# EAGLE design DyIO_Rev12 (EAGLE 5.11)
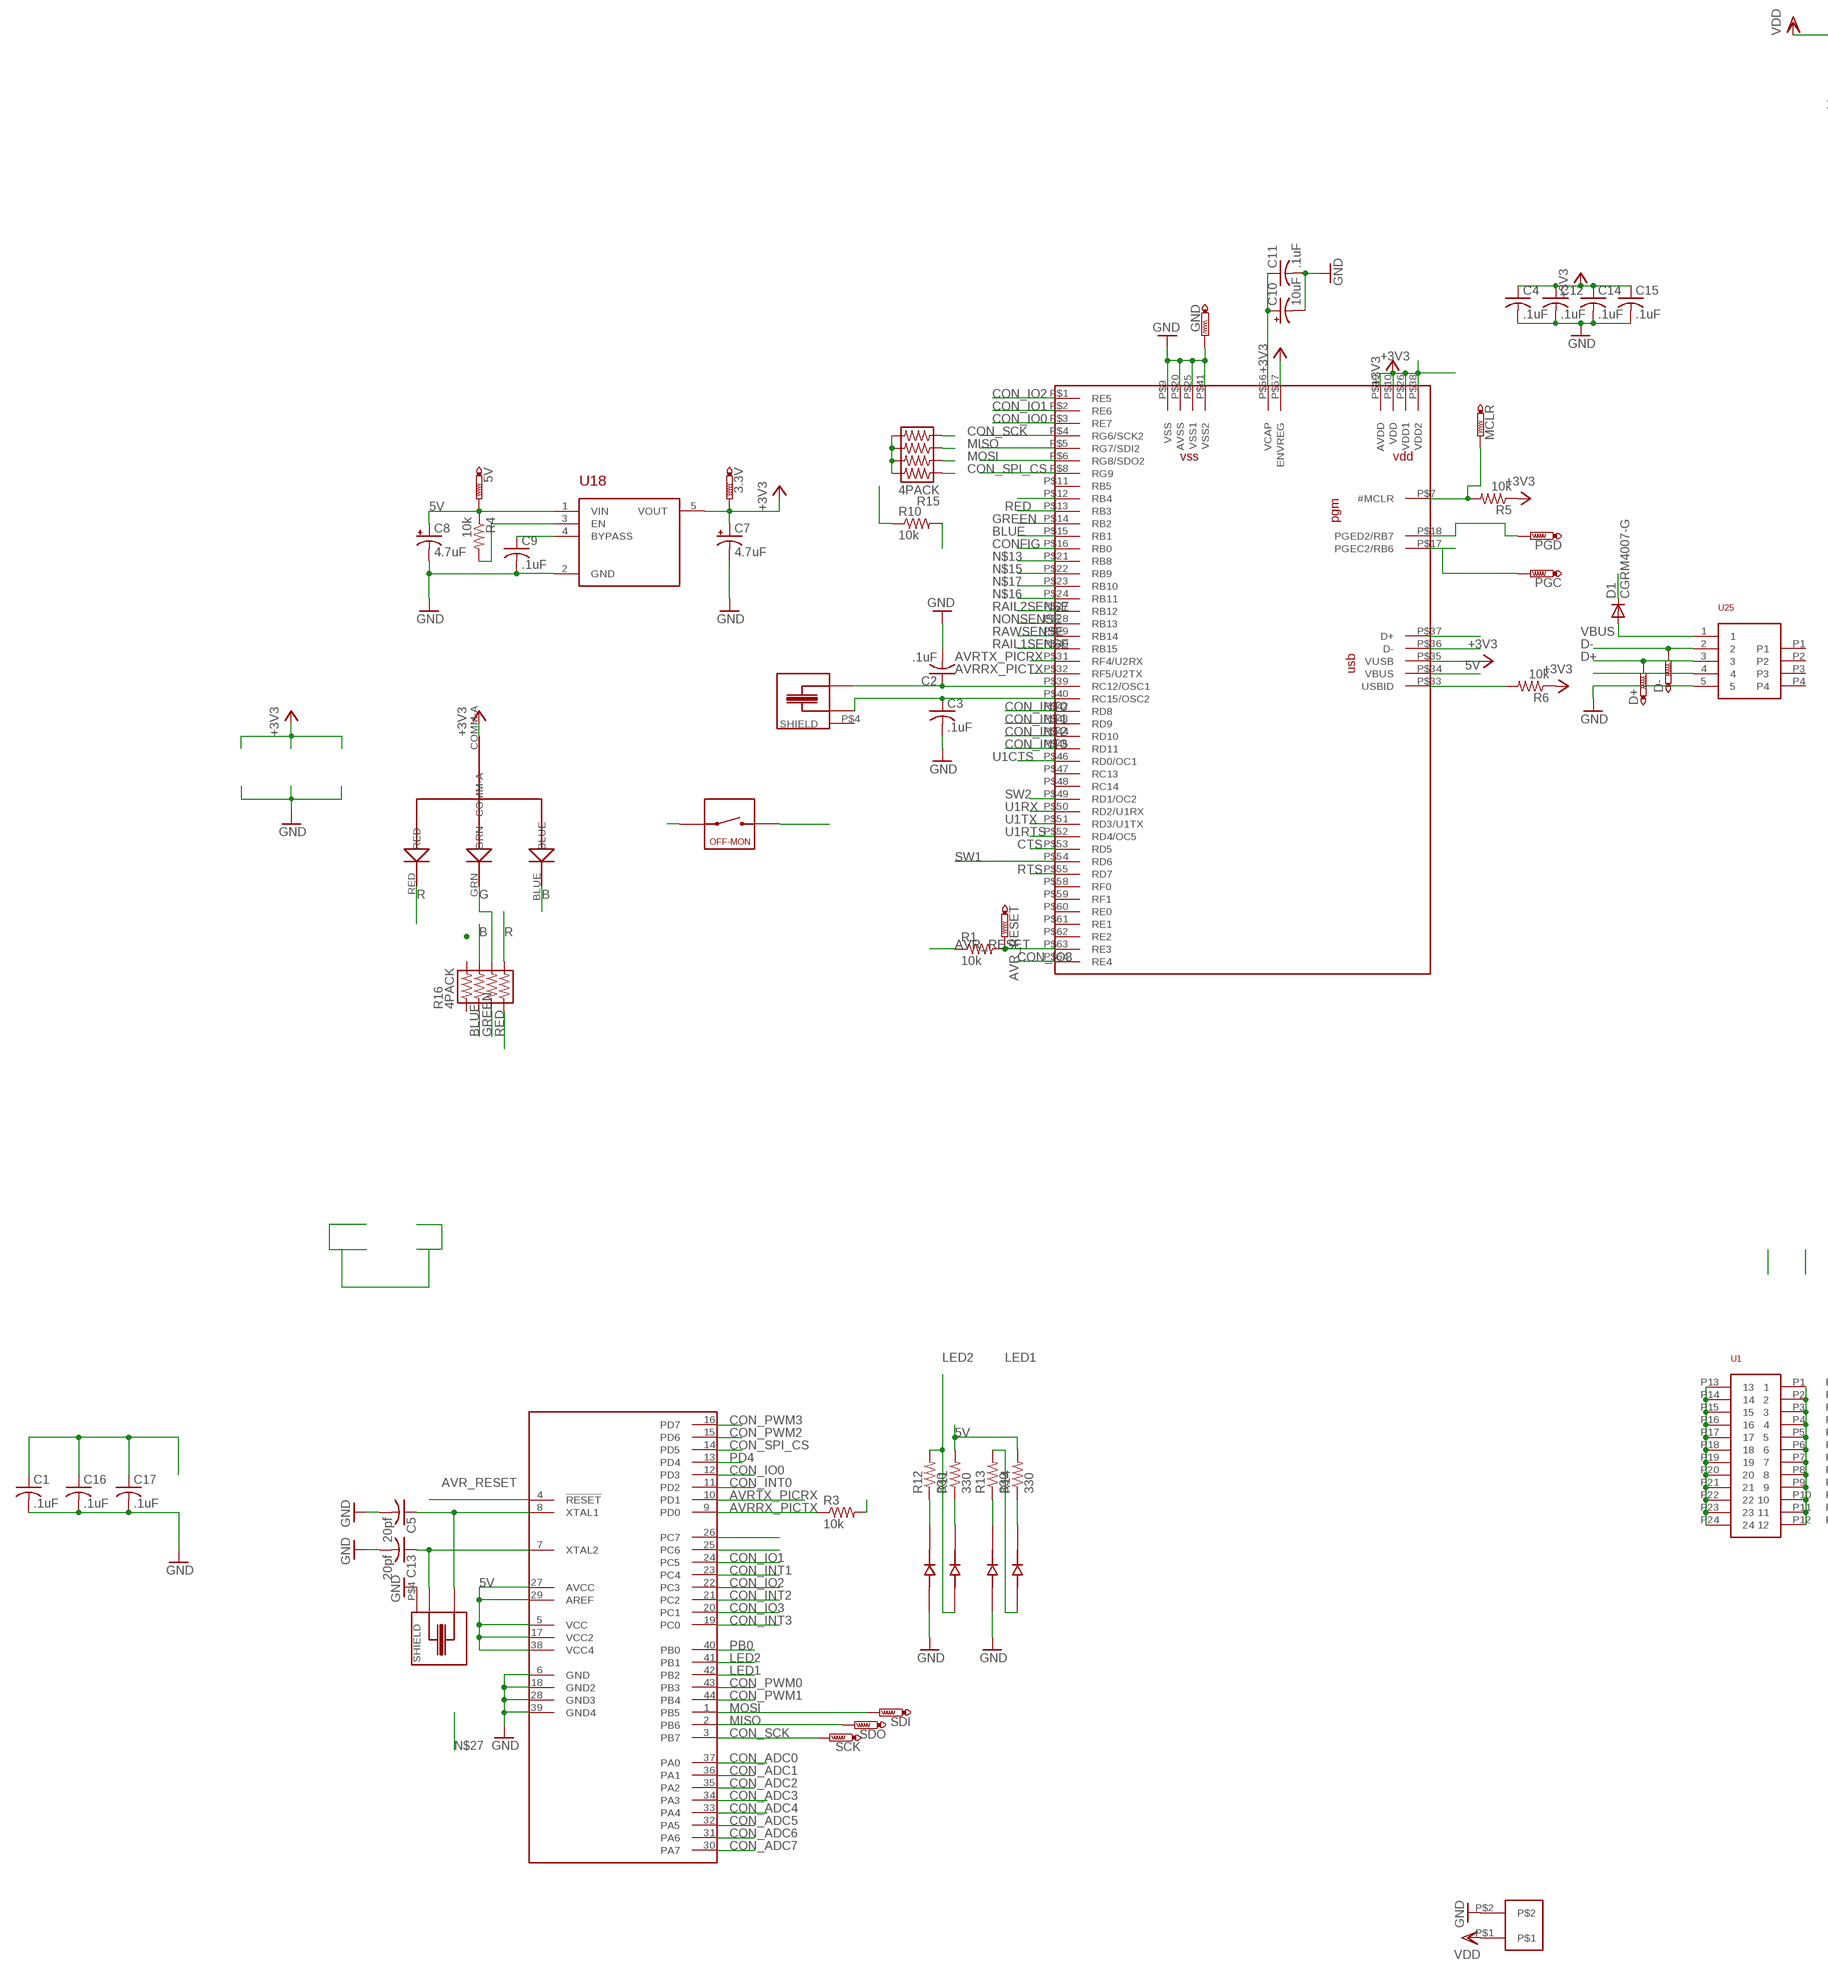
[diagram p0: schematic, sheet 1, part 1 of 2]
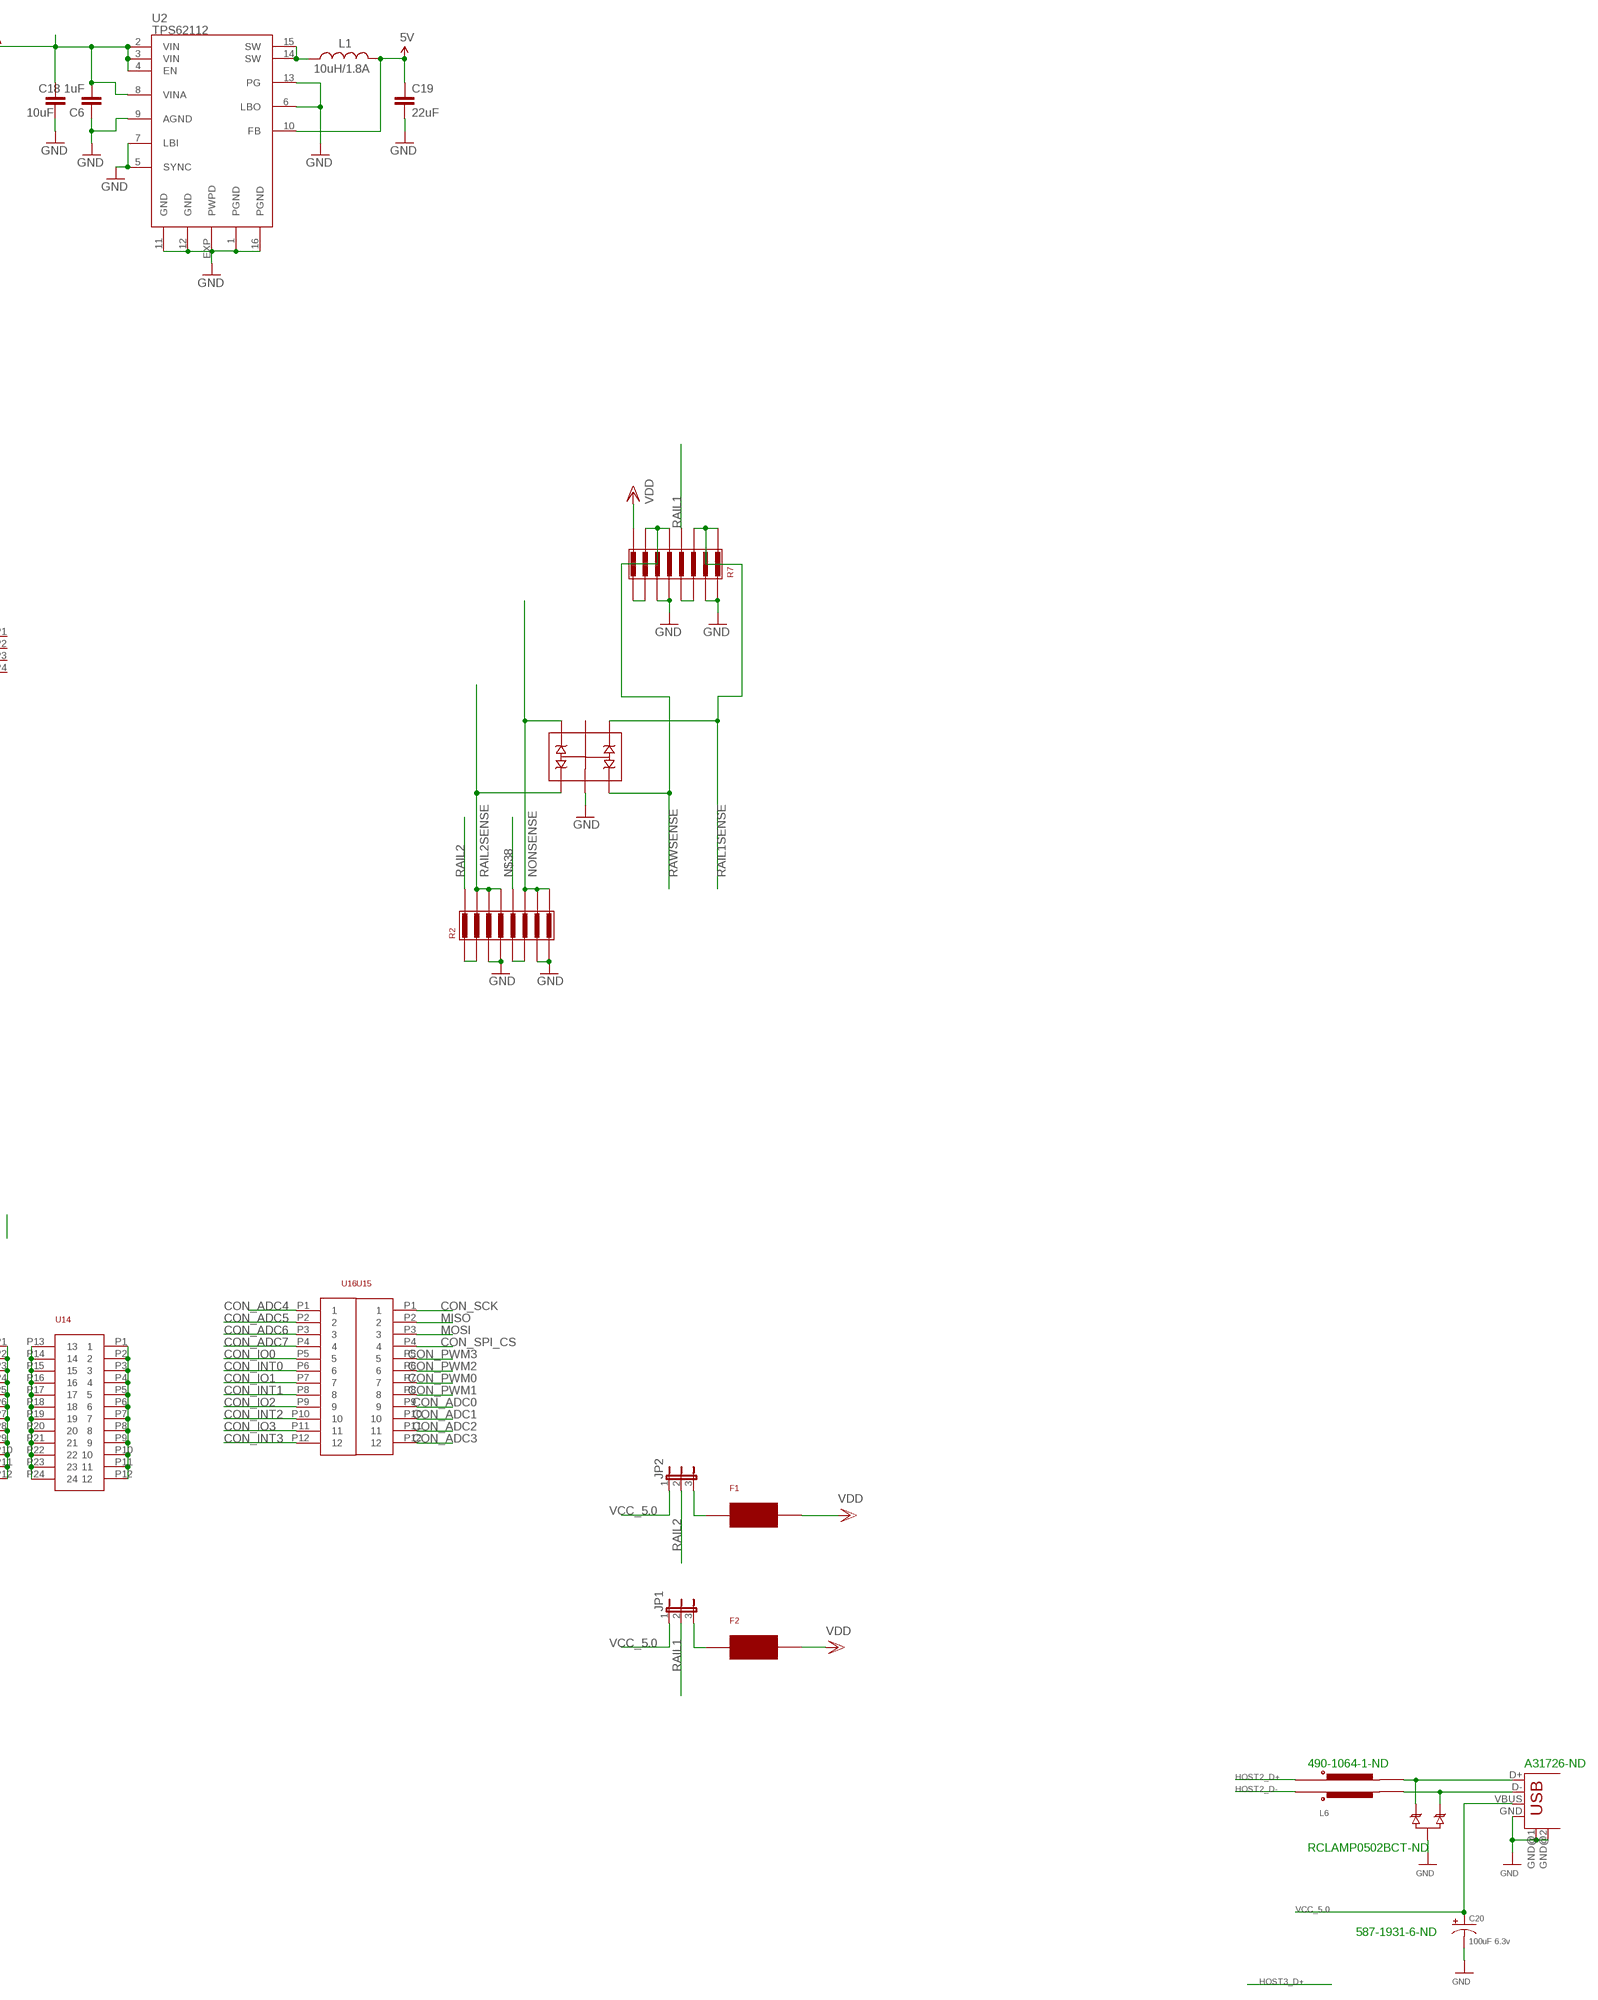
[diagram p1: schematic, sheet 1, part 2 of 2]

## Parts
3.3V  PTR1TP14R  [TP14R]
5V  PTR1TP14R  [TP14R]
AVR_RESET  PTR1TP14R  [TP14R]
C1  .1uF  C-USC0603  [C0603]
C2  .1uF  C-USC0603  [C0603]
C3  .1uF  C-USC0603  [C0603]
C4  .1uF  C-USC0603  [C0603]
C5  20pf  C-USC0603  [C0603]
C6  1uF  CAP0805  [0805]
C7  4.7uF  CPOL-USR/2012-12R  [R/2012-12R]
C8  4.7uF  CPOL-USR/2012-12R  [R/2012-12R]
C9  .1uF  C-USC0402  [C0402]
C10  10uF  CPOL-USR/2012-12R  [R/2012-12R]
C11  .1uF  C-USC0603  [C0603]
C12  .1uF  C-USC0603  [C0603]
C13  20pf  C-USC0603  [C0603]
C14  .1uF  C-USC0603  [C0603]
C15  .1uF  C-USC0603  [C0603]
C16  .1uF  C-USC0603  [C0603]
C17  .1uF  C-USC0603  [C0603]
C18  10uF  CAP1210  [1210]
C19  22uF  CAP1210  [1210]
C20  100uF 6.3v  CPOL-USE1.8-4  [E1,8-4]
D1  CGRM4007-G  [SOD-123_MINI-SMA]
D+  PTR1TP14R  [TP14R]
D-  PTR1TP14R  [TP14R]
F1  0154  [0154]
F2  0154  [0154]
GND  PTR1B1,27  [B1,27]
JP1  JP2E  [JP2]
JP2  JP2E  [JP2]
L1  10uH/1.8A  INDUCTORSRU5028  [SRU5028]
L6  FERITE_S0805  [SPLIT_0805]
MCLR  PTR1TP14R  [TP14R]
PGC  PTR1TP14R  [TP14R]
PGD  PTR1TP14R  [TP14R]
R1  10k  R-US_R0603  [R0603]
R2  741X163  [741X163]
R3  10k  R-US_R0603  [R0603]
R4  10k  R-US_R0402  [R0402]
R5  10k  R-US_R0603  [R0603]
R6  10k  R-US_R0603  [R0603]
R7  741X163  [741X163]
R10  10k  R-US_R0603  [R0603]
R11  330  R-US_R0603  [R0603]
R12  330  R-US_R0603  [R0603]
R13  330  R-US_R0603  [R0603]
R14  330  R-US_R0603  [R0603]
R15  4PACK  [4PACK_0603]
R16  4PACK  [4PACK_0603]
SCK  PTR1TP14R  [TP14R]
SDI  PTR1TP14R  [TP14R]
SDO  PTR1TP14R  [TP14R]
SW3  SPST  [B3U-1000P]
U1  2X12  [2X12]
U2  TPS62112  TPS6211  [QFN16-4X4]
U3  PIC32-64TQFP64-2  [TQFP64-2]
U6  RCLAMP0502B  [SOT-523]
U7  2CLED  [1.6X1.5]
U8  TRI-LED-SMD  [TRI_LED_SMD]
U13  2CLED  [1.6X1.5]
U14  2X12  [2X12]
U15  1X12  [1X12]
U16  1X12  [1X12]
U18  LDS3985XX33  [SOT23-5]
U25  1734035-1_USB  [1734035-1_1734035]
U$2  ATMEGA644QFP  [TQFP44]
U$19  2P  [2PTH]
U$20  UCLAMP3304A  [UCLAMP3304A]
USB2  USB-A-H  [USB-A-H]
X2  CMR3XXT  [CMR309T]
X4  CMR3XXT  [CMR309T]

## Nets
5V: 5V.TP C1.1 C8.+ C16.1 C17.1 C19.1 D1.C L1.2 R1.1 R3.2 R4.1 R11.2 R14.2 R15.R1A R15.R2A R15.R3A R15.R4A U2.10(FB) U3.P$34(VBUS) U18.1(VIN) U$2.5(VCC) U$2.17(VCC2) U$2.27(AVCC) U$2.29(AREF) U$2.38(VCC4)
32MCLR: MCLR.TP R5.2 U3.P$7(#MCLR)
32PGC: PGC.TP U3.P$17(PGEC2/RB6)
32PGD: PGD.TP U3.P$18(PGED2/RB7)
+3V3: 3.3V.TP C4.1 C7.+ C12.1 C14.1 C15.1 R5.1 R6.1 SW3.P$1 U3.P$10(VDD) U3.P$19(AVDD) U3.P$26(VDD1) U3.P$35(VUSB) U3.P$38(VDD2) U3.P$57(ENVREG) U8.COMM-A U18.5(VOUT)
AVR_RESET: AVR_RESET.TP R1.2 U3.P$63(RE3) U$2.4(!RESET)
AVRRX_PICTX: R3.1 U3.P$32(RF5/U2TX) U$2.9(PD0)
AVRTX_PICRX: U3.P$31(RF4/U2RX) U$2.10(PD1)
B: R16.R2A U8.BLUE
BLUE: R16.R2B U3.P$15(RB1)
CON_ADC0: U15.P9 U$2.37(PA0)
CON_ADC1: U15.P10 U$2.36(PA1)
CON_ADC2: U15.P11 U$2.35(PA2)
CON_ADC3: U15.P12 U$2.34(PA3)
CON_ADC4: U16.P1 U$2.33(PA4)
CON_ADC5: U16.P2 U$2.32(PA5)
CON_ADC6: U16.P3 U$2.31(PA6)
CON_ADC7: U16.P4 U$2.30(PA7)
CON_INT0: U3.P$42(RD8) U16.P6 U$2.11(PD2)
CON_INT1: U3.P$43(RD9) U16.P8 U$2.23(PC4)
CON_INT2: U3.P$44(RD10) U16.P10 U$2.21(PC2)
CON_INT3: U3.P$45(RD11) U16.P12 U$2.19(PC0)
CON_IO0: U3.P$3(RE7) U16.P5 U$2.12(PD3)
CON_IO1: U3.P$2(RE6) U16.P7 U$2.24(PC5)
CON_IO2: U3.P$1(RE5) U16.P9 U$2.22(PC3)
CON_IO3: U3.P$64(RE4) U16.P11 U$2.20(PC1)
CON_PWM0: U15.P7 U$2.43(PB3)
CON_PWM1: U15.P8 U$2.44(PB4)
CON_PWM2: U15.P6 U$2.15(PD6)
CON_PWM3: U15.P5 U$2.16(PD7)
CON_SCK: R15.R4B SCK.TP U3.P$4(RG6/SCK2) U15.P1 U$2.3(PB7)
CON_SPI_CS: R15.R1B U3.P$8(RG9) U15.P4 U$2.14(PD5)
CONFIG: R10.2 SW3.P$3 U3.P$16(RB0)
CTS: U3.P$53(RD5) U$2.26(PC7)
D+: D+.TP U3.P$37(D+) U25.3
D-: D-.TP U3.P$36(D-) U25.2
G: R16.R3A U8.GRN
GND: C1.2 C2.2 C3.2 C4.2 C5.2 C6.1 C7.- C8.- C9.2 C10.- C11.2 C12.2 C13.2 C14.2 C15.2 C16.2 C17.2 C18.2 C19.2 C20.- GND.PP(TP) R2.R3A R2.R4A R2.R7A R2.R8A R7.R1A R7.R2A R7.R5A R7.R6A R10.1 U1.P13 U1.P14 U1.P15 U1.P16 U1.P17 U1.P18 U1.P19 U1.P20 U1.P21 U1.P22 U1.P23 U1.P24 U2.1(PGND) U2.5(SYNC) U2.6(LBO) U2.7(LBI) U2.9(AGND) U2.11(GND) U2.12(GND) U2.13(PG) U2.16(PGND) U2.EXP(PWPD) U3.P$9(VSS) U3.P$20(AVSS) U3.P$25(VSS1) U3.P$41(VSS2) U6.3 U7.1T U13.1T U14.P1 U14.P2 U14.P3 U14.P4 U14.P5 U14.P6 U14.P7 U14.P8 U14.P9 U14.P10 U14.P11 U14.P12 U18.2(GND) U25.5 U$2.6(GND) U$2.18(GND2) U$2.28(GND3) U$2.39(GND4) U$19.P$2 U$20.2 USB2.GND USB2.GND@1(GND) USB2.GND@2(GND) X4.P$4(SHIELD)
GREEN: R16.R3B U3.P$14(RB2)
HOST2_D+: L6.1
HOST2_D-: L6.4
LED1: R13.2 U13.2T U$2.42(PB2)
LED2: R12.2 U7.2T U$2.41(PB1)
MISO: R15.R3B SDO.TP U3.P$5(RG7/SDI2) U15.P2 U$2.2(PB6)
MOSI: R15.R2B SDI.TP U3.P$6(RG8/SDO2) U15.P3 U$2.1(PB5)
N$2: R4.2 U18.3(EN)
N$3: C9.1 U18.4(BYPASS)
N$4: C3.1 U3.P$40(RC15/OSC2) X2.P$3
N$5: C10.+ C11.1 U3.P$56(VCAP)
N$6: C2.1 U3.P$39(RC12/OSC1) X2.P$1
N$8: C5.1 U$2.8(XTAL1) X4.P$1
N$9: C13.1 U$2.7(XTAL2) X4.P$3
N$10: L6.2 U6.2 USB2.D+
N$12: R7.R7A R7.R8A
N$13: U3.P$21(RB8)
N$14: R12.1 U7.1A
N$15: U3.P$22(RB9)
N$16: U3.P$24(RB11)
N$17: U3.P$23(RB10)
N$19: L6.3 U6.1 USB2.D-
N$20: F1.1 JP2.3
N$21: F2.1 JP1.3
N$23: U3.P$12(RB4)
N$25: R13.1 U13.1A
N$26: R11.1 U7.2A
N$30: R14.1 U13.2A
N$33: R2.R5A R2.R6A
N$35: R7.R3A R7.R4A
N$36: R2.R1A R2.R2A
N$38: R2.R5B
NONSENSE: R2.R6B R2.R7B R2.R8B U3.P$28(RB13) U$20.6
PB0: U$2.40(PB0)
PD4: U$2.13(PD4)
R: R16.R4A U8.RED
RAIL1: R7.R4B U14.P13 U14.P14 U14.P15 U14.P16 U14.P17 U14.P18 U14.P19 U14.P20 U14.P21 U14.P22 U14.P23 U14.P24
RAIL1SENSE: R7.R1B R7.R2B R7.R3B U3.P$30(RB15) U$20.4
RAIL2: JP2.2 R2.R1B U1.P1 U1.P2 U1.P3 U1.P4 U1.P5 U1.P6 U1.P7 U1.P8 U1.P9 U1.P10 U1.P11 U1.P12
RAIL2SENSE: R2.R2B R2.R3B R2.R4B U3.P$27(RB12) U$20.1
RAWSENSE: R7.R5B R7.R6B R7.R7B U3.P$29(RB14) U$20.3
RED: R16.R4B U3.P$13(RB3)
RTS: U3.P$55(RD7) U$2.25(PC6)
SW: L1.1 U2.14(SW) U2.15(SW)
SW1: U3.P$54(RD6)
SW2: U3.P$49(RD1/OC2)
U1CTS: U3.P$46(RD0/OC1)
U1RTS: U3.P$52(RD4/OC5)
U1RX: U3.P$50(RD2/U1RX)
U1TX: U3.P$51(RD3/U1TX)
USBID: R6.2 U3.P$33(USBID) U25.4
VBUS: D1.A U25.1
VCC_5.0: C20.+ JP1.1 JP2.1 USB2.VBUS
VDD: C6.2 C18.1 F1.2 F2.2 R7.R8B U2.2(VIN) U2.3(VIN) U2.4(EN) U2.8(VINA) U$19.P$1
Unconnected: JP1.2 R16.R1A R16.R1B U3.P$11(RB5) U3.P$47(RC13) U3.P$48(RC14) U3.P$58(RF0) U3.P$59(RF1) U3.P$60(RE0) U3.P$61(RE1) U3.P$62(RE2) U25.P1 U25.P2 U25.P3 U25.P4 U$20.5 X2.P$4(SHIELD)

## Notes on the sheet
- 490-1064-1-ND | A31726-ND
- RCLAMP0502BCT-ND
- 587-1931-6-ND

## Library data of the parts
3.3V 5V AVR_RESET D+ D- GND MCLR PGC PGD SCK SDI SDO = testpad:PTR1: TEST PIN
C1-C5 C9 C11-C17 = rcl:C-US: CAPACITOR, American symbol
C6 C18 C19 = SparkFun:CAP: Capacitor Standard 0603 ceramic capacitor, and 0.1" leaded capacitor.
C7 C8 C10 C20 = rcl:CPOL-US: POLARIZED CAPACITOR, American symbol
D1 = diode:CGRM400*-G: Molded plasitc,JEDEC SOD-123/Mini SMA Source: Comchip CGRM4001-G.pdf
F1 F2 = SMT_Fuse_0154001:0154
JP1 JP2 = jumper:JP2E: JUMPER
L1 = SparkFun:INDUCTOR: Inductors Basic Inductor/Choke - 0603 and 1206. Footprints are not proven and vary greatly between part numbers.
L6 = ferrite_split_0805:FERITE_S0805
R1 R3-R6 R10-R14 = rcl:R-US_: RESISTOR, American symbol
R2 R7 = 741X163:741X163
R15 R16 = ResistorBlocks:4PACK: This is a 0603x4 resistor block. Digikey PN:MNR14103RCT-ND
SW3 = B3U-1000P:SPST
U1 U14 = 1x12_header:2X12
U2 = SparkFun:TPS6211*: TPS62112: 1.5A Step-Down Converter
U3 = pic32:PIC32-64
U6 = rclamp0502b:RCLAMP0502B
U7 U13 = 2cled:2CLED: 160-1452-1-ND
U8 = TRI_LED_SMD:TRI-LED-SMD: Common Annode smd tri-color RGB led.
U15 U16 = 1x12_header:1X12
U18 = LDS3985XX33:LDS3985XX33
U25 = YESIN_USB:1734035-1_USB
U$2 = atmega644:ATMEGA644
U$19 = con_2h_70555-0001:2P
U$20 = UCLAMP3304A:UCLAMP3304A
USB2 = con-usb-2:USB: USB Connectors
X2 X4 = cmr3XXT:CMR3XXT

## Board
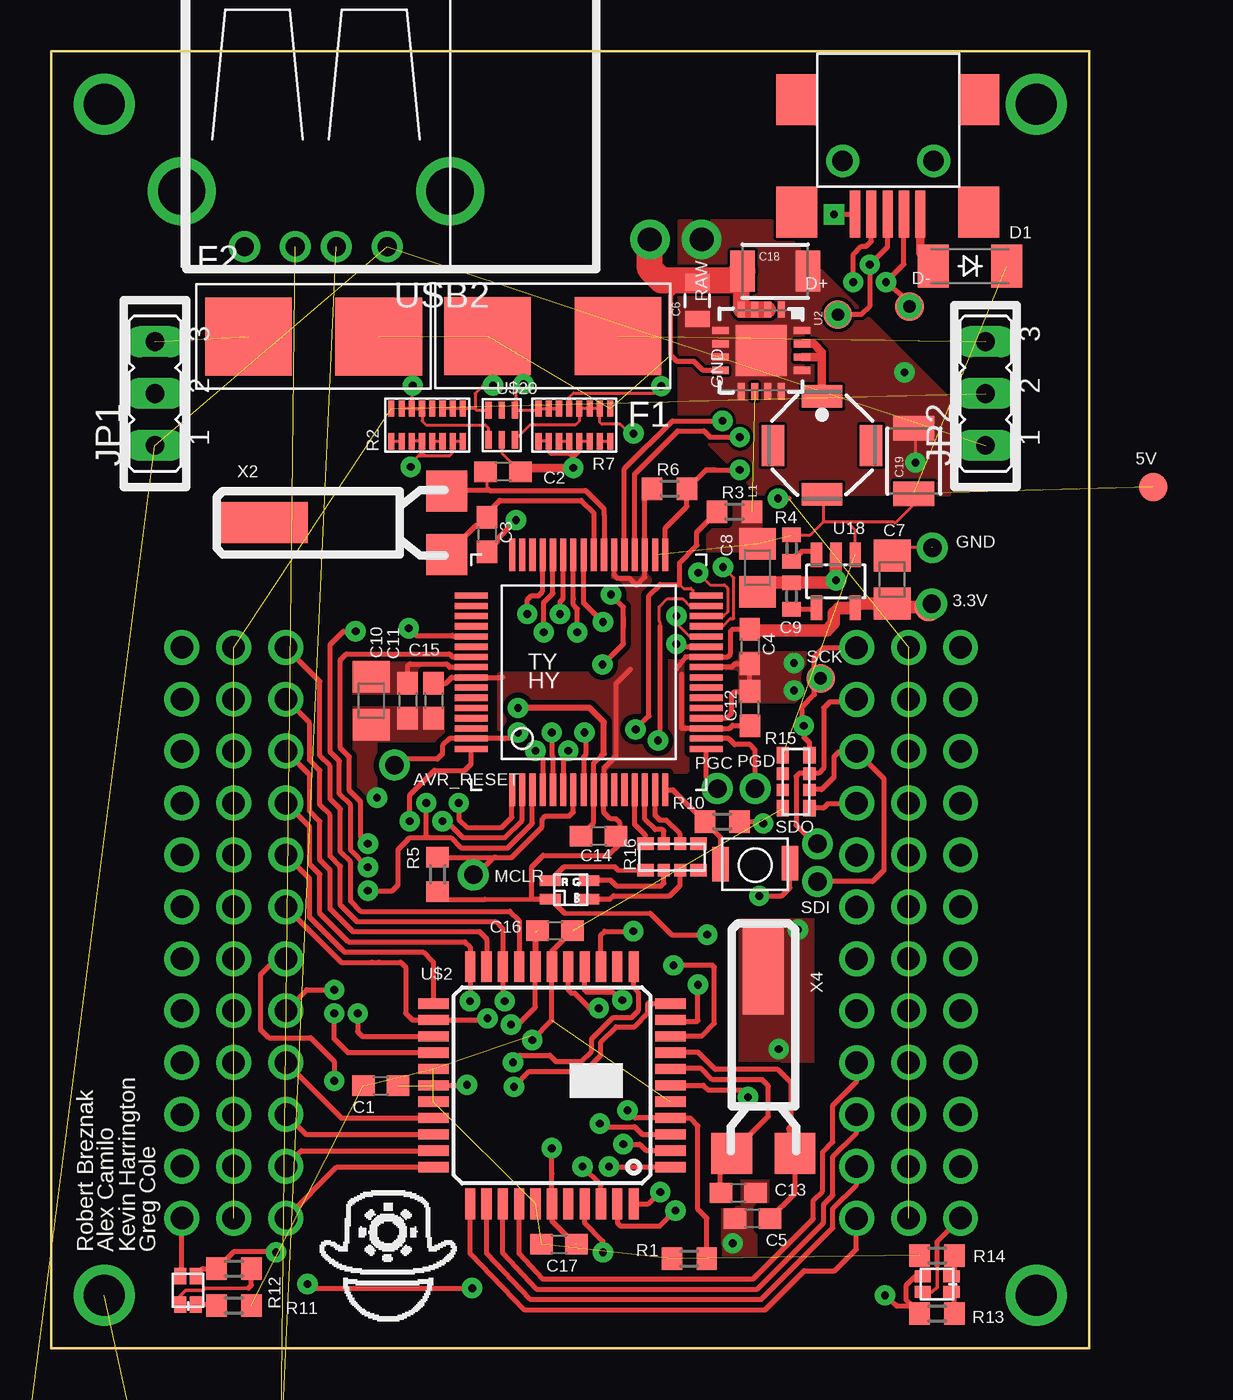
[diagram p2: board, top side]
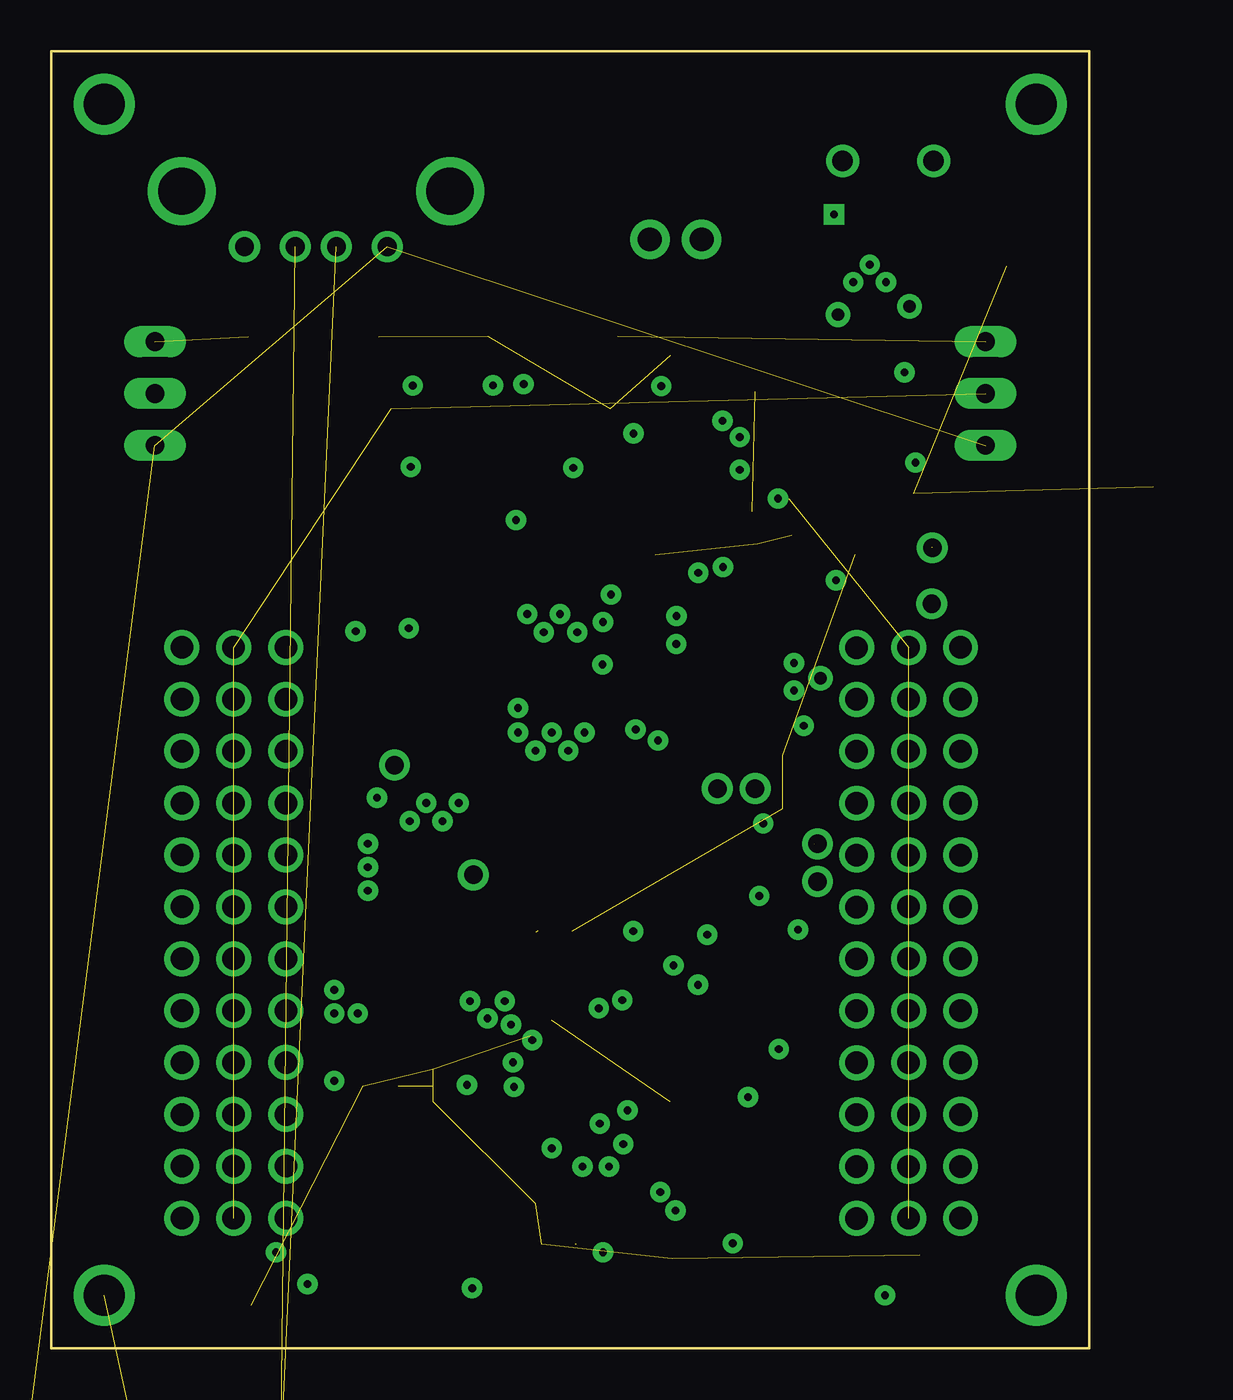
[diagram p3: board, inner layer Route2]
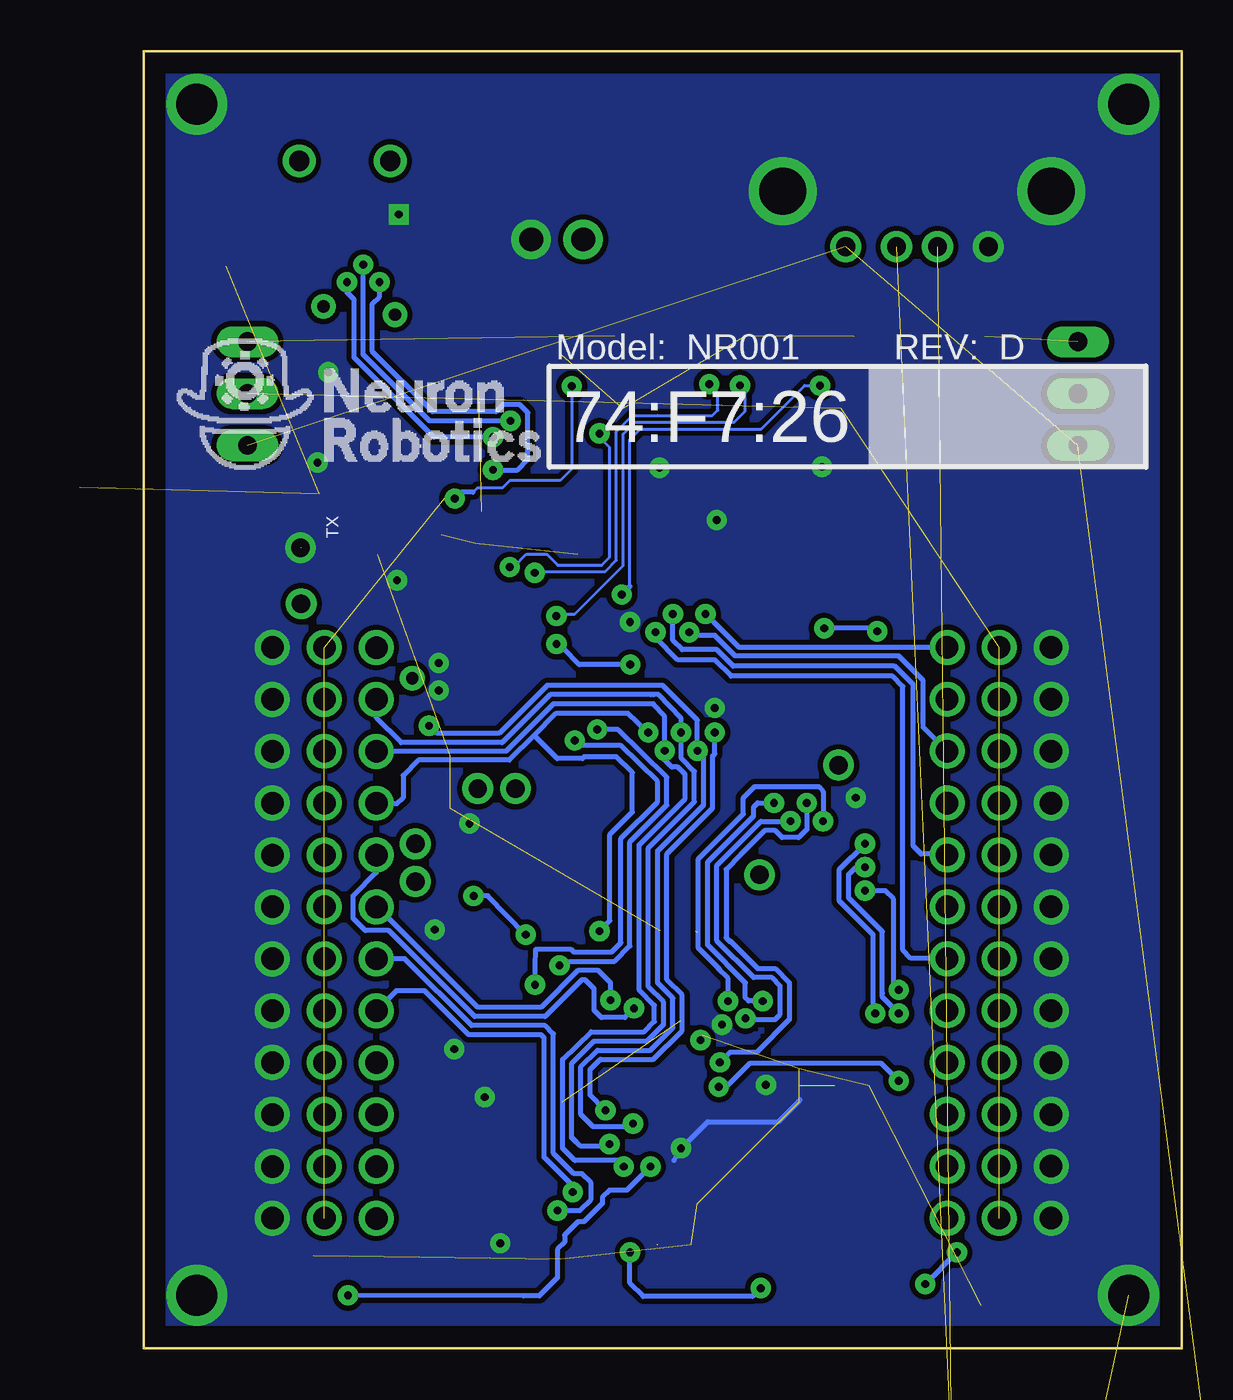
[diagram p4: board, bottom side, seen from below]

Size 50.8 x 63.5 mm. Coordinates in mm from the lower left corner, seen from the top.
Copper layers (1*2+3*16): Top 0.035mm / dielectric 1.5mm / Route2 0.035mm / dielectric 0.15mm / Route3 0.035mm / dielectric 0.2mm / Bottom 0.035mm
Design rules "default *": minimum track width 6mil, minimum drill 15mil, track to track 6mil, track to pad 6mil, pad to pad 6mil, via to via 6mil, smd to smd 6mil, copper to edge 40mil, drill to drill 6mil, minimum pad ring 12mil, minimum via ring 12mil, stop-mask expansion 4mil, vias tented up to drill 20mil, thermal gap 0mil

### Footprints (pad centres in the part's own frame; a part is rotated, then mirrored left to right if it is on the bottom)
TP14R = smd 1.4 x 1.4: TP 0,0
C0603 = smd 1.1 x 1: 1 -0.85,0; 2 0.85,0
0805 = smd 0.8 x 1.2: 1 -0.9,0; 2 0.9,0
R/2012-12R = smd 1.55 x 1.8: + 1.175,0; - -1.175,0
C0402 = smd 0.7 x 0.9: 1 -0.65,0; 2 0.65,0
1210 = smd 1.2 x 2: 1 -1.6,0; 2 1.6,0
E1,8-4 = drill 0.711 pad 1.168 round: + -0.889,0 | drill 0.711 pad 1.168 octagon: - 0.889,0
SOD-123_MINI-SMA = smd 1.5 x 2.1: A 1.8,0; C -1.8,0
0154 = smd 4.24 x 3.81: 1 0,0; 2 6.38,0
B1,27 = smd 1.27 x 1.27: PP 0,0
JP2 = drill 0.914 long: 1 -2.54,0; 2 0,0; 3 2.54,0
SRU5028 = smd 1.1 x 2: 1 2.4,0; 2 -2.4,0 | smd 2 x 1.1: P$1 0,2.4; P$2 0,-2.4
SPLIT_0805 = smd 0.45 x 0.4: 1 0.225,-0.2; 2 1.775,-0.2; 3 1.775,-1; 4 0.225,-1
R0603 = smd 1 x 1.1: 1 -0.85,0; 2 0.85,0
741X163 = smd 0.3 x 0.8: R1A 0,0.4; R1B 0,2; R2A 0.5,0.4; R2B 0.5,2; R3A 1,0.4; R3B 1,2; R4A 1.5,0.4; R4B 1.5,2; R5A 2,0.4; R5B 2,2; R6A 2.5,0.4; R6B 2.5,2; R7A 3,0.4; R7B 3,2; R8A 3.5,0.4; R8B 3.5,2
R0402 = smd 0.7 x 0.9: 1 -0.65,0; 2 0.65,0
4PACK_0603 = smd 0.8 x 0.6: R1A -2.78,-0.6; R1B -2.78,-1.9; R4A -0.18,-0.6; R4B -0.18,-1.9 | smd 0.6 x 0.6: R2A -1.88,-0.6; R2B -1.88,-1.9; R3A -1.08,-0.6; R3B -1.08,-1.9
B3U-1000P = smd 0.8 x 1.7: P$1 0.4,-0.1; P$3 3.8,-0.05
2X12 = drill 1.1 round: P1 -0.635,0.635; P2 1.905,0.635; P3 4.445,0.635; P4 6.985,0.635; P5 9.525,0.635; P6 12.065,0.635; P7 14.605,0.635; P8 17.145,0.635; P9 19.685,0.635; P10 22.225,0.635; P11 24.765,0.635; P12 27.305,0.635; P13 -0.635,-1.905; P14 1.905,-1.905; P15 4.445,-1.905; P16 6.985,-1.905; P17 9.525,-1.905; P18 12.065,-1.905; P19 14.605,-1.905; P20 17.145,-1.905; P21 19.685,-1.905; P22 22.225,-1.905; P23 24.765,-1.905; P24 27.305,-1.905
QFN16-4X4 = smd 0.8 x 0.35: 1 -2,0.975; 2 -2,0.325; 3 -2,-0.325; 4 -2,-0.975; 9 2,-0.975; 10 2,-0.325; 11 2,0.325; 12 2,0.975 | smd 0.35 x 0.8: 5 -0.975,-2; 6 -0.325,-2; 7 0.325,-2; 8 0.975,-2; 13 0.975,2; 14 0.325,2; 15 -0.325,2; 16 -0.975,2 | smd 2.5 x 2.5: EXP 0,0
TQFP64-2 = smd 1.6 x 0.3: P$1 0,-2; P$2 0,-2.5; P$3 0,-3; P$4 0,-3.5; P$5 0,-4; P$6 0,-4.5; P$7 0,-5; P$8 0,-5.5; P$9 0,-6; P$10 0,-6.5; P$11 0,-7; P$12 0,-7.5; P$13 0,-8; P$14 0,-8.5; P$15 0,-9; P$16 0,-9.5; P$33 11.5,-9.5; P$34 11.5,-9; P$35 11.5,-8.5; P$36 11.5,-8; P$37 11.5,-7.5; P$38 11.5,-7; P$39 11.5,-6.5; P$40 11.5,-6; P$41 11.5,-5.5; P$42 11.5,-5; P$43 11.5,-4.5; P$44 11.5,-4; P$45 11.5,-3.5; P$46 11.5,-3; P$47 11.5,-2.5; P$48 11.5,-2 | smd 0.3 x 1.6: P$17 2,-11.5; P$18 2.5,-11.5; P$19 3,-11.5; P$20 3.5,-11.5; P$21 4,-11.5; P$22 4.5,-11.5; P$23 5,-11.5; P$24 5.5,-11.5; P$25 6,-11.5; P$26 6.5,-11.5; P$27 7,-11.5; P$28 7.5,-11.5; P$29 8,-11.5; P$30 8.5,-11.5; P$31 9,-11.5; P$32 9.5,-11.5; P$49 9.5,0; P$50 9,0; P$51 8.5,0; P$52 8,0; P$53 7.5,0; P$54 7,0; P$55 6.5,0; P$56 6,0; P$57 5.5,0; P$58 5,0; P$59 4.5,0; P$60 4,0; P$61 3.5,0; P$62 3,0; P$63 2.5,0; P$64 2,0
SOT-523 = smd 0.4 x 0.8: 1 0,0; 2 1,0; 3 0.5,1.4
1.6X1.5 = smd 0.6 x 0.8: 1A 0.37,0.1; 1T 0.37,1.5; 2A 1.13,0.1; 2T 1.13,1.5
TRI_LED_SMD = smd 1.016 x 0.508: BLUE 1.7,-1.2; COMM-A -0.2,-1.2; GRN 1.7,-0.3; RED -0.2,-0.3
1X12 = drill 1.1 round: P1 -10.795,3.175; P2 -8.255,3.175; P3 -5.715,3.175; P4 -3.175,3.175; P5 -0.635,3.175; P6 1.905,3.175; P7 4.445,3.175; P8 6.985,3.175; P9 9.525,3.175; P10 12.065,3.175; P11 14.605,3.175; P12 17.145,3.175
SOT23-5 = smd 0.55 x 1.2: 1 -0.95,-1.3; 2 0,-1.3; 3 0.95,-1.3; 4 0.95,1.3; 5 -0.95,1.3
1734035-1_1734035 = smd 2.3 x 0.5: 1 -1.15,1.6; 2 -1.15,0.8; 3 -1.15,0; 4 -1.15,-0.8; 5 -1.15,-1.6 | smd 2.5 x 2: P1 -6.75,4.45; P2 -1.25,4.45; P3 -1.25,-4.45; P4 -6.75,-4.45 | drill 1 pad 1.3 round: P$1 -3.75,-2.2; P$2 -3.75,2.25
TQFP44 = smd 1.5 x 0.5: 1 -5.8,4; 2 -5.8,3.2; 3 -5.8,2.4; 4 -5.8,1.6; 5 -5.8,0.8; 6 -5.8,0; 7 -5.8,-0.8; 8 -5.8,-1.6; 9 -5.8,-2.4; 10 -5.8,-3.2; 11 -5.8,-4; 23 5.8,-4; 24 5.8,-3.2; 25 5.8,-2.4; 26 5.8,-1.6; 27 5.8,-0.8; 28 5.8,0; 29 5.8,0.8; 30 5.8,1.6; 31 5.8,2.4; 32 5.8,3.2; 33 5.8,4 | smd 0.5 x 1.5: 12 -4,-5.8; 13 -3.2,-5.8; 14 -2.4,-5.8; 15 -1.6,-5.8; 16 -0.8,-5.8; 17 0,-5.8; 18 0.8,-5.8; 19 1.6,-5.8; 20 2.4,-5.8; 21 3.2,-5.8; 22 4,-5.8; 34 4,5.8; 35 3.2,5.8; 36 2.4,5.8; 37 1.6,5.8; 38 0.8,5.8; 39 0,5.8; 40 -0.8,5.8; 41 -1.6,5.8; 42 -2.4,5.8; 43 -3.2,5.8; 44 -4,5.8
2PTH = drill 1.168 pad 1.93 round: P$1 -2.54,0; P$2 0,0
UCLAMP3304A = smd 0.3 x 0.85: 1 0,-1.025; 2 0.65,-1.025; 3 1.3,-1.025; 4 1.3,0.425; 5 0.65,0.425; 6 0,0.425
USB-A-H = drill 0.914 round: D+ 2.718,-1.003; D- 2.718,1.003; GND 2.718,-3.493; VBUS 2.718,3.493 | drill 2.311 round: GND@1 0,6.566; GND@2 0,-6.566
CMR309T = smd 2 x 2: P$1 1,1.7; P$3 1,-1.4 | smd 4.5 x 2: P$4 -8.05,0.15

### Placement (x,y rotation side)
3.3V  42.95,36.3 0 top
5V  53.92,42.16 0 top  (outside the outline)
AVR_RESET  16.8,28.55 0 top
C1  16.13,12.86 0 top
C2  22.11,42.92 0 top
C3  21.33,39.84 270 top
C4  34.18,34.36 270 top
C5  34.32,6.37 180 top
C6  31.62,51.28 90 top
C7  41.16,37.63 270 top
C8  34.56,38.21 90 top
C9  36.23,36.83 90 top
C10  15.66,31.7 90 top
C11  17.44,31.7 270 top
C12  34.2,31.32 90 top
C13  33.63,7.62 0 top
C14  26.78,25.07 180 top
C15  18.71,31.7 270 top
C16  24.66,20.44 180 top
C17  24.85,5.1 0 top
C18  35.43,52.73 0 top
C19  42.21,43.43 90 top
C20  -4.06,-33.78 0 top  (outside the outline)
D1  44.96,52.98 180 top
D+  38.5,50.6 0 top
D-  42,51 0 top
F1  27.74,49.56 180 top
F2  9.65,49.53 0 top
GND  43.09,39.21 0 top
JP1  5.08,46.74 90 top
JP2  45.72,46.74 90 top
L1  37.72,44.2 90 top
L6  -4.83,-38.1 0 top  (outside the outline)
MCLR  20.66,23.25 0 top
PGC  32.6,27.4 90 top
PGD  34.45,27.4 90 top
R1  31.23,4.39 0 top
R2  16.65,44 0 top
R3  33.44,40.95 0 top
R4  36.23,39.17 270 top
R5  18.91,23.2 90 top
R6  30.26,42.08 0 top
R7  23.85,44 0 top
R10  32.83,25.78 180 top
R11  8.95,2.1 0 top
R12  8.95,3.9 180 top
R13  43.35,1.7 180 top
R14  43.35,4.55 180 top
R15  35.2,29.21 90 top
R16  28.9,22.8 180 top
SCK  37.65,32.8 0 top
SDI  37.5,22.85 0 top
SDO  37.5,24.7 0 top
SW3  36.55,23.65 180 top
U1  8.3,33.68 270 top
U2  34.75,48.84 270 top
U3  20.56,27.35 90 top
U6  9.91,-34.54 0 top  (outside the outline)
U7  5.95,2.05 0 top
U8  24.62,23.2 0 top
U13  44.15,2.4 90 top
U14  43.86,33.68 270 top
U15  42.59,23.51 270 bottom
U16  14.66,17.17 90 top
U18  38.4,37.55 180 top
U25  40.93,54.37 270 top
U$2  24.51,12.88 180 top
U$5  [OUTLINE]  0,0 0 top
U$19  31.83,54.28 0 top
U$20  21.4,45.5 0 top
USB2  12.95,56.64 270 top
X2  18.35,40.27 0 top
X4  34.7,10.55 270 top

### Tracks (layer width: path | path; a pad name or v marks a point on that pad's centre or on a via)
5V  (via drill 0.38)  (19 unrouted)
  Top 0.152: R4.1 37.15,39.82 37.8,40.46 | 37.8,40.46 37.8,41.72 L1.2 | 37.8,40.46 38.41,40.46 38.94,40.46 | 38.94,40.46 39.32,40.08 39.32,38.88 U18.1 | C19.1 42.22,41.3 41.3,40.39 41.22,40.46 38.94,40.46
  Top 0.254: C16.1 24.51,19.44 U$2.17 24.51,16.05 v23.55,15.09
  Route2 0.254: v23.55,15.09 23.55,15.24 23.47,15.32
  pour Top (isolate 0.254): 32.05,41.25 32.05,39 34.8,39 34.8,41.25
32MCLR
  Top 0.254: U3.P$7 25.56,26.26 25.36,26.06 24.19,26.06 24.03,25.9 24.03,25.53 22.53,24.03 21.77,24.03 | 21.77,24.03 21.65,24.03 20.7,23.08 MCLR.TP | R5.2 18.93,24.03 21.77,24.03
32PGC  (via drill 0.9)
  Top 0.152: PGC.TP 32.77,27.94
  Top 0.254: U3.P$17 32.06,29.31 32.05,29.3 | 32.05,29.3 32.05,27.95 PGC.TP | 32.05,29.3 U3.P$17
  other vias: 32.6,27.4
32PGD
  Top 0.254: U3.P$18 33.15,29.85 33.45,29.55 34.2,29.55 34.45,29.3 PGD.TP
+3V3  (via drill 0.38)
  Top 0.254: C12.1 34.17,30.5 33.35,30.5 33.2,30.35 U3.P$19 32.1,30.35 | C4.1 33.35,35.2 33.25,35.1 33.25,34 33.1,33.85 U3.P$26 31.05,33.85 30.6,33.25 | C15.1 19.3,32.55 19.6,32.85 U3.P$57 22.1,32.85 | 32.1,30.35 30.85,30.35 30.85,33 | 32.1,30.35 32.15,30.35 | R6.1 29.06,41.72 U3.P$35 29.06,37.76 28.65,37.35 28.3,37.7 27.7,37.7 27.56,37.84 U3.P$38 | SW3.P$1 36.15,22.55 35.75,22.15 v34.65,22.15 | 27.06,28.34 U3.P$10 27.05,26.23 27.36,25.92 27.63,25.92 27.84,25.71 27.84,24.73 | 27.06,28.34 27.05,28.35 | 27.06,28.34 27.06,28.41 27.65,29 27.65,32.55 28.35,33.25 | 27.84,24.73 C14.1 | v32.1,20.25 30.36,20.25 29.31,21.3 25.11,21.31 U8.COMM-A 23.52,21.99 | R5.1 19.28,21.98 21.23,21.98 21.24,21.99 23.52,21.99 | 27.84,24.73 27.25,24.13 24.08,24.13 23.52,23.57 23.52,21.99
  Top 0.61: 3.3V.TP 41.31,36.3 C7.+ 39.56,36.46 U18.5 38.55,36.25 38.3,36 38.3,35.5 37.95,35.15 34.24,35.15 C4.1
  Bottom 0.254: v32.1,20.25 33.95,22.15 v34.65,22.15
  pour Top (isolate 0.254): 21.95,33 27.4,33 27.4,38.15 27.7,38.15 27.7,37.8 28.9,37.8 28.9,38.2 29.2,38.2 29.2,37.6 31.1,37.6 31.1,33.45 32.1,33.45 32.1,33.2 31.1,33.2 31.1,28.25 27.2,28.25 27.2,27.9 26.9,27.9 26.9,28.55 24.1,28.55 24.1,30.1 21.95,30.1
AVR_RESET  (via drill 0.38)
  Top 0.254: 22.2,29.85 U3.P$63 19.5,29.85 19.15,29.5 19.15,29.1 18.9,28.85 17.1,28.85 AVR_RESET.TP | 22.2,29.85 | v28.2,11.65 28.57,11.28 U$2.4 30.33,11.25 31.3,11.25 31.65,10.9 31.65,6.8 32.08,6.37 R1.2 | 22.2,29.85 22.55,29.85 v22.85,30.15
  Bottom 0.254: v28.2,11.65 28.95,12.4 28.95,13.65 28.45,14.15 25.85,14.15 24.45,15.55 24.45,17.3 25.2,18.05 25.2,24.2 22.95,26.45 22.95,29 22.85,29.1 v22.85,30.15 22.9,30.1
AVRRX_PICTX  (via drill 0.38)
  Top 0.153: 31.4,36.85 31.4,37.1 31.3,37.2 30.95,37.2 30.75,37.4
  Top 0.254: U3.P$32 31.4,36.85 | R3.1 31.6,39.97 31.6,39.3 30.75,38.45 30.75,37.4 29.8,37.4 29.25,36.85 29.25,30.95 v28.6,30.3 | v30.45,18.75 32.35,18.75 32.45,18.65 32.45,15.9 31.85,15.3 30.33,15.3 U$2.9
  Bottom 0.254: v28.6,30.3 27.6,30.3 25.2,27.95 25.2,26.6 27,24.8 27,19.7 27.75,18.95 30.25,18.95 v30.45,18.75
AVRTX_PICRX  (via drill 0.38)
  Top 0.153: 29.8,35.35 29.8,35.55 29.75,35.6 29.75,36.3 30.15,36.7 30.9,36.7 31.25,36.35 U3.P$31
  Top 0.254: U3.P$31 | v31.65,17.8 31.65,16.05 31.6,16 30.38,16 U$2.10 | 29.8,35.35 29.8,29.85 v29.7,29.75
  Bottom 0.254: v29.7,29.75 29.65,29.5 27.45,29.5 25.65,27.75 25.65,26.75 27.45,24.95 27.45,19.85 27.9,19.4 29.75,19.4 29.9,19.55 31.6,19.55 v31.65,17.8
B
  Top 0.254: U8.BLUE 27.35,22 27.51,22.16 30.27,22.15 30.78,22.66 R16.R2A
BLUE
  Top 0.254: U3.P$15 29.56,26.09 29.8,25.85 30.1,25.85 30.78,25.17 R16.R2B
CON_ADC0
  Top 0.254: U$2.37 22.91,4.64 24.05,3.4 34.35,3.4 37.3,6.35 37.3,7.25 37.75,7.7 37.75,9.6 38.25,10.1 38.25,11.9 39.41,13.06 U15.P9
CON_ADC1
  Top 0.254: 39.41,11.16 U15.P10 39.41,10.56 38.25,9.4 38.25,7.5 37.8,7.05 37.8,6.15 34.55,2.9 23.75,2.9 22.11,4.64 U$2.36
CON_ADC2
  Top 0.254: U$2.35 21.31,4.64 23.45,2.4 34.75,2.4 38.25,5.9 38.25,6.85 39.41,8.01 U15.P11
CON_ADC3
  Top 0.254: U$2.34 20.51,4.64 23.15,1.9 34.95,1.9 36.85,3.8 38.35,3.8 39.4,4.85 39.4,6.35 U15.P12
CON_ADC4
  Top 0.254: U16.P1 13.99,8.88 U$2.33
CON_ADC5
  Top 0.254: U16.P2 12.25,9.68 U$2.32
CON_ADC6
  Top 0.254: U$2.31 12.46,10.48 U16.P3
CON_ADC7
  Top 0.254: U16.P4 14.2,11.28 U$2.30
CON_INT0  (via drill 0.38)
  Top 0.254: U3.P$42 25.56,36.71 25.55,36.7 25.55,36.4 25.75,36.2 v25.75,35.05 | U$2.11 29.92,16.88 29.9,16.9 29.2,16.9 29.2,16.4 28.55,15.75 27.65,15.75 26.9,15 26.9,14.35 26.1,13.55 23.4,13.55 v22.65,12.8 | U16.P6 11.02,19.07 10.25,18.3 10.25,15.6 10.65,15.2 12.7,15.2 13.85,14.05 v13.85,13.1
  Bottom 0.153: U16.P6 11.51,19.07 11.52,19.08 11.95,19.08 11.97,19.1
  Bottom 0.254: 25.75,35 v25.75,35.05 25.75,34.8 24.65,33.7 22.85,33.7 22.05,32.9 14.15,32.9 13.65,32.4 13.65,19.5 13.25,19.1 11.97,19.1 11.51,19.1 | 13.85,12.95 v13.85,13.1 14.7,13.95 21.15,13.95 22.3,12.8 v22.65,12.8
CON_INT1  (via drill 0.38)
  Top 0.254: U3.P$43 25.05,36.7 24.9,36.55 v24.9,35.95 | U16.P8 12.65,22.98 12.65,21.1 14.35,19.4 18.2,19.4 18.7,18.9 U$2.23
  Bottom 0.254: v24.9,35.95 24.9,34.65 24.45,34.2 22.75,34.2 21.95,33.4 14.05,33.4 13.15,32.5 13.15,24.6 12.75,24.2 11.53,24.2 U16.P8
CON_INT2  (via drill 0.38)
  Top 0.254: U3.P$44 24.55,36.95 24.1,36.5 v24.1,35.05 | U16.P10 12.65,28.07 12.65,26.3 13.15,25.8 13.15,23.9 13.65,23.4 13.65,21.5 14.75,20.4 20.95,20.4 21.31,20.04 U$2.21
  Bottom 0.254: v24.1,35.05 23.95,34.9 22.85,34.9 21.85,33.9 13.85,33.9 12.65,32.7 12.65,30.4 U16.P10
CON_INT3  (via drill 0.38)
  Top 0.254: U3.P$45 24.05,37.05 23.85,36.85 23.5,36.85 23.3,36.65 v23.3,35.95 | U16.P12 13.15,32.65 13.15,29 13.65,28.5 13.65,26.9 14.15,26.4 14.15,24.3 14.65,23.8 14.65,21.9 15.15,21.4 22.45,21.4 22.91,20.94 U$2.19
  Bottom 0.254: v23.3,35.95 21.66,34.31 U16.P12
CON_IO0  (via drill 0.38)
  Top 0.254: U3.P$3 23.55,25.7 22.35,24.5 20.05,24.5 19.55,25 18.47,25 | U16.P5 12.5,17.55 v13.85,17.55 | v15.5,22.4 16.7,22.4 16.98,22.68 16.98,24.42 17.3,24.75 | U$2.12 28.51,18.61 28.5,18.6 28.5,17.7 28.75,17.4 28.75,16.55 28.4,16.2 27.5,16.2 26.45,15.15 26.45,14.55 25.95,14.05 24.7,14.05 24.4,14.35 22.95,14.35 v22.6,14 | 17.3,24.75 17.46,24.9 | 18.47,25 17.56,25 17.3,24.75 | v18.35,26.7 18.35,25.12 18.47,25
  Bottom 0.152: U16.P5 11.43,16.51 | 21.61,24.14 21.59,24.13
  Bottom 0.254: v18.35,26.7 18.35,25.4 18.75,25 19.55,25 19.9,25.35 20.4,25.35 21.61,24.14 22.3,23.45 22.3,20.1 22.1,19.9 22.1,19.95 20.75,18.6 19.9,18.6 19.2,17.9 19.2,16.1 20.8,14.5 22.1,14.5 v22.6,14 22.4,14 | v13.85,17.55 14.1,17.8 14.1,22 14.5,22.4 v15.5,22.4
CON_IO1  (via drill 0.38)
  Top 0.254: U3.P$2 23.05,25.85 22.2,25 20.15,25 19.35,25.8 v19.15,25.8 | U16.P7 14.2,18.9 15.7,18.9 | 15.7,18.9 16.05,18.9 | v21.35,16.15 21.28,16.08 U$2.24 17.67,16.08 17.35,16.4 17.35,18.65 17.1,18.9 15.7,18.9
  Bottom 0.254: v19.15,25.8 20.6,25.8 22.75,23.65 22.75,19.95 20.95,18.15 20.05,18.15 19.65,17.75 19.65,16.35 19.9,16.1 21.3,16.1 v21.35,16.15
CON_IO2  (via drill 0.38)
  Top 0.254: U3.P$1 22.55,26 22.05,25.5 20.35,25.5 19.95,25.9 v19.95,26.7 | U16.P9 12.65,25.53 12.65,23.7 13.15,23.2 13.15,21.3 14.55,19.9 20.25,19.9 20.51,19.64 U$2.22 v20.51,17.01 v20.5,17
  Bottom 0.254: v19.95,26.7 20.75,26.7 20.95,26.5 20.95,26.05 23.2,23.8 23.2,19.75 21.35,17.9 21.35,17.15 21.2,17 v20.5,17
CON_IO3  (via drill 0.38)
  Top 0.254: U3.P$64 20.55,28.6 20.25,28.3 18.75,28.3 17.55,27.1 v17.55,25.8 | U16.P11 12.65,30.61 12.65,28.8 13.15,28.3 13.15,26.6 13.65,26.1 13.65,24.1 14.15,23.6 14.15,21.7 14.95,20.9 21.75,20.9 22.11,20.54 U$2.20 22.11,17.09 v22.2,17
  Bottom 0.254: v22.2,17 22.2,18.1 22.7,18.6 22.6,18.55 23.65,19.6 23.65,23.95 21.45,26.15 21.45,26.95 20.9,27.5 17.75,27.5 17.55,27.25 v17.55,25.8
CON_PWM0  (via drill 0.38)
  Top 0.254: U$2.43 27.71,6.14 27.85,6 29.8,6 v30.55,6.75
  Bottom 0.254: v30.55,6.75 29.45,6.75 28.9,7.3 28.9,8.1 29.35,8.55 29.75,8.55 30.75,9.55 30.75,15.4 31.15,15.8 34.75,15.8 38.02,19.07 U15.P7
CON_PWM1  (via drill 0.38)
  Top 0.254: U$2.44 29.23,7.08 v29.8,7.65
  Bottom 0.254: v29.8,7.65 29.8,7.95 31.2,9.35 31.2,15.2 31.35,15.35 34.9,15.35 37.05,17.5 38.44,17.5 U15.P8
CON_PWM2  (via drill 0.38)
  Top 0.254: U$2.15 26.11,17.54 26.2,17.45 27.45,17.45 27.85,17.05 v27.95,17.05
  Bottom 0.254: v27.95,17.05 27.95,17.9 28.55,18.5 29.55,18.5 31.35,16.7 34.45,16.7 39.35,21.61 U15.P6
CON_PWM3  (via drill 0.38)
  Top 0.254: U$2.16 25.31,17.54 25.45,17.4 25.6,17.4 26.35,16.65 v26.8,16.65
  Bottom 0.254: v26.8,16.65 27.25,16.2 28.4,16.2 28.75,16.55 28.75,17.6 29.2,18.05 29.35,18.05 31.15,16.25 34.6,16.25 38.8,20.45 39.95,20.45 40.55,21.05 40.55,22.15 39.41,23.29 U15.P5
CON_SCK  (via drill 0.38, 0.6)
  Top 0.152: U15.P1 39.37,34.29 39.37,34.3
  Top 0.254: 24.05,27.4 U3.P$4 | 24.05,27.4 24.05,28.9 v23.7,29.25 | U$2.3 28.92,10.48 28.55,10.85 27,10.85 v26.85,11 | U15.P1 39.37,34.3 37.8,34.3 37.35,33.85 37.35,32.6 | 37.35,32.6 37.35,32 36.75,31.4 36.75,30.6 36.85,30.5 36.85,30.45 | SCK.TP 37.55,32.8 37.35,32.6 | R15.R4B 37.1,29.05 37.1,29.65 36.85,29.9 36.85,30.45 | U3.P$4 24.06,27.39 24.05,27.4 | v36.83,30.48 v36.83,30.47 36.85,30.45
  Bottom 0.254: 25.85,32.45 25.4,32.45 23.7,30.75 v23.7,29.25 23.4,28.95 23.4,26.6 25.65,24.35 25.65,17.9 24.9,17.15 24.9,15.7 26,14.6 28.6,14.6 29.4,13.8 29.4,11.45 28.8,10.85 27,10.85 v26.85,11 26.75,10.9 | 25.85,32.45 26.15,32.45 | 25.85,32.45 31.05,32.45 33.4,30.1 36.45,30.1 v36.83,30.48
  other vias: 37.65,32.8
CON_SPI_CS  (via drill 0.38)
  Top 0.152: 39.37,26.65 39.37,26.67 U15.P4
  Top 0.254: U3.P$8 26.05,28.95 26.15,29.05 26.15,30.1 v26.1,30.15 | U$2.14 26.91,20.24 27.08,20.42 v28.49,20.42 28.47,20.4 | 39.4,26.65 39.37,26.65 38,26.65 37.8,26.45 37.15,26.45 37.13,26.43 R15.R1B
  Bottom 0.152: U15.P4 39.37,26.67 39.37,26.65
  Bottom 0.254: 39.38,26.65 39.37,26.65 38.4,26.65 38.1,26.95 38.1,28.05 37.35,28.8 32.9,28.8 31.7,30 | 31.7,30 30.6,31.1 27.1,31.1 v26.1,30.15 | v28.49,20.42 27.98,20.93 27.98,25.15 26.88,26.25 26.88,28.18 27.66,28.96 29.24,28.96 29.33,28.87 30.56,28.87 31.7,30
CONFIG
  Top 0.254: U3.P$16 30.42,27.35 R10.2 32.75,25.02 SW3.P$3
CTS  (via drill 0.38)
  Top 0.254: v17.5,35.25 17.85,34.9 19.65,34.9 19.7,34.85 U3.P$53 | v14.9,35.1 14.3,35.1 13.65,34.45 13.65,29.2 14.1,28.75 14.1,27.15 14.65,26.6 14.65,24.4 v15.5,23.55 | U$2.26 14.52,14.48 13.85,15.15 v13.85,16.4
  Bottom 0.254: v17.5,35.25 15.05,35.25 v14.9,35.1 | v15.5,23.55 15.95,23.55 16.3,23.2 16.3,22.05 14.65,20.4 14.65,17.4 14.65,17.2 v13.85,16.4
D+  (via drill 0.38, 0.6)
  Top 0.254: U3.P$37 28.06,43.06 30.4,45.4 v32.85,45.4 | D+.TP 39.65,50.6 40.05,51 v40.05,53.04 40.93,53.92 U25.3
  Bottom 0.254: v40.05,53.04 40.05,48.65 36.8,45.4 v32.85,45.4
  other vias: 38.5,50.6
D-  (via drill 0.38, 0.6)
  Top 0.254: U3.P$36 28.56,42.81 30.65,44.9 31.95,44.9 32.25,44.6 v33.7,44.6 | D-.TP 42,51.25 v40.85,52.19 41.73,53.07 U25.2
  Bottom 0.254: v40.85,52.19 40.85,51.69 40.5,51.34 40.5,48.5 36.6,44.6 v33.7,44.6
  other vias: 42,51
G
  Top 0.254: U8.GRN 26.34,22.91 27.38,22.91 27.65,22.64 29.83,22.63 29.98,22.78 R16.R3A
GND  (via drill 0.38, 0.9, 2)  (6 unrouted)
  Top 0.152: C19.2 42.29,44.96 v42.29,43.36
  Top 0.153: U$20.2 22.05,43.83 C2.2 | R7.R1A R7.R2A 24.35,43.85 24.45,43.75 25.35,43.75 | R7.R6A R7.R5A 25.85,43.85 25.75,43.75 | R2.R3A R2.R4A 18.15,43.85 | R2.R8A R2.R7A 19.65,43.85 19.5,43.7 18.3,43.7 | 18.15,43.85 18.3,43.7 | v17.6,43.15 17.6,43.3 18,43.7 | 18,43.7 18.15,43.85 | 18,43.7 18.3,43.7 | 25.75,43.75 25.45,43.75 | v25.55,43.1 25.55,43.55 | 25.55,43.55 25.75,43.75 | 25.55,43.55 25.35,43.75 | 25.35,43.75 25.45,43.75 | 25.45,43.75 25.55,43.65 | GND.PP 41.56,39.21
  Top 0.17: 43.35,4.05 43.35,3 43.12,2.77 U13.1T
  Top 0.254: U3.P$25 33.3,33.35 33.45,33.5 C4.2 34.2,33.49 C12.2 34.17,32.15 33.45,32.15 33.3,32 33.3,31.1 33.05,30.85 U3.P$20 | 25.65,5.1 24.51,6.24 U$2.39 24.51,8.56 v24.5,9.8 | 27.05,29.1 26.92,28.99 26.55,28.65 U3.P$9 26.55,25.72 26.13,25.3 C14.2 | U$2.6 31.92,12.88 32.15,12.65 33.75,12.65 v34.1,12.3 | R10.1 34.85,25.78 v34.85,25.7 | U14.P12 43.35,5.23 43.35,4.05 | 41.56,39.21 C7.- | v20.35,12.9 20.33,12.88 U$2.28 18.68,12.86 | U7.1T 6.39,3.62 U1.P24 | C3.2 21.85,39.51 21.85,39.65 v22.75,40.55 | U3.P$41 26.06,36.49 v27,35.55 | v22.5,15.85 22.85,15.85 23.7,16.7 U$2.18 | U25.5 39.3,55.49 v38.31,55.5
  Top 0.305: v22.85,31.35 26.35,31.35 27.05,30.65 27.05,29.11 26.92,28.99 | U$2.18 23.71,20.35
  Top 0.406: C2.2 23.15,43.1 v25.55,43.1
  Top 0.61: U18.2 v38.4,37.6 38.18,37.48 C9.2 35,37.48 C8.-
  Bottom 0.152: v42.29,43.36 42.37,43.28 42.44,43.28
  Bottom 0.153: v43.12,39.19 42.88,39.2 42.88,39.21
  Bottom 0.254: v34.1,12.3 34.1,12.05 | 24.85,9.2 v24.5,9.8 23.2,11.1 19.75,11.1 18.68,12.17 | v27,35.55 27,35.3 27.05,35.25 | v38.31,55.5 38.37,55.51 38.37,55.67
  Bottom 0.61: v38.4,37.6 38.25,37.55
  other vias: 36.35,33.55 36.35,32.2 33.35,5.15 36.55,20.5 35.6,14.65 15.95,26.95 2.6,2.6 48.2,2.6 48.2,60.9 2.6,60.9 41.76,47.78
  pour Top (isolate 0.254): 33.65,34.1 36.95,34.1 36.95,31.6 33.65,31.6 33.65,33.1 33.55,33.2 32.85,33.2 32.85,33.5 33.25,33.5 33.45,33.7 33.65,33.7
  pour Top (isolate 0.254): 19.25,31.4 14.75,31.4 14.75,29.7 19.25,29.7
  pour Top (isolate 0.254): 32.8,4.75 32.8,6.95 33.75,6.95 33.75,8.25 35.15,8.25 35.15,6.95 34.55,6.95 34.55,4.5 32.8,4.5
  pour Top (isolate 0.254): 37.35,21.05 37.35,14 33.65,14 33.65,21.05
  pour Top (isolate 0.254): 14.75,29.7 14.75,26.85 15.95,26.85 15.95,29.7
  pour Top: 30.71,55.17 30.71,45.72 34.59,41.83 35.2,41.83 43.97,41.76 43.97,46.48 35.28,55.17
  pour Bottom (isolate 0.254): 0,63.47 0,0 50.83,0 50.83,63.47
GREEN
  Top 0.254: 29.98,24.97 R16.R3B 29.98,25.32 29.9,25.4 29.55,25.4 29.06,25.89 U3.P$14
LED1  (via drill 0.38)
  Top 0.254: U$2.42 26.91,7.06 26.9,7.05 26.9,8 v26,8.9 | v40.8,2.6 41.3,2.15 41.38,2.08 42.12,2.08 | 42.5,1.65 R13.2 42.12,2.08 | 42.12,2.08 41.85,2.35 41.85,3.1 42.28,3.53 U13.2T
  Bottom 0.254: v40.8,2.6 32.2,2.56 31.43,2.56 30.55,3.45 30.55,4.85 30.2,5.2 30.2,5.55 29.55,6.2 29.25,6.2 28.35,7.1 28.35,7.4 28,7.75 27.15,7.75 v26,8.9
LED2  (via drill 0.38)
  Top 0.254: v27,4.7 27,5.25 26.1,6.15 U$2.41 | U7.2T 7.43,3.9 R12.2 8.95,4.75 10.65,4.75 10.7,4.7 v11,4.7 | v20.6,2.95 12.75,2.95 v12.55,3.15
  Bottom 0.254: v27,4.7 27,3.2 26.35,2.55 21,2.55 v20.6,2.95 | v11,4.7 v12.55,3.15
MISO  (via drill 0.38, 0.9)  (1 unrouted)
  Top 0.152: 39.35,31.65 39.37,31.75 U15.P2
  Top 0.254: U3.P$5 24.55,28.95 24.5,29 v24.5,30.15 | 39.35,31.65 38.1,31.65 37.8,31.35 37.8,28.4 37.55,28.15 37.15,28.15 | 37.15,28.15 37.1,28.15 | 37.35,24.7 36.45,25.6 36.45,28 36.58,28.13 R15.R3B 37.13,28.13 37.15,28.15 | v28,10 28.8,10 29.1,9.7 30.28,9.7 U$2.2
  Bottom 0.153: SDO.TP 37.35,24.7
  Bottom 0.254: 29.85,10.3 29.65,10.1 | 29.85,10.3 29.85,13.95 28.75,15.05 26.15,15.05 25.35,15.85 25.35,16.95 26.1,17.7 26.1,24.5 23.85,26.75 23.85,28.25 24.5,28.9 v24.5,30.15 24.5,30.85 25.6,32 25.85,32 | 25.85,32 26,32 | U15.P2 39.41,30.86 38.2,29.65 33.25,29.65 30.9,32 25.85,32 | 29.85,10.3 29.8,10.3 29.4,9.9 28.1,9.9 v28,10 27.85,9.85
  other vias: 37.5,24.7
MOSI  (via drill 0.38, 0.9)
  Top 0.152: 39.37,29.2 39.37,29.21 U15.P3
  Top 0.254: U3.P$6 25.05,29 v25.3,29.25 | 39.4,29.2 39.37,29.2 38.55,29.2 38.3,28.95 38.3,27.95 37.7,27.35 37.15,27.35 | 37.15,27.35 37.1,27.35 | U15.P3 40.75,27.89 40.75,23.4 40.2,22.85 SDI.TP | R15.R2B 37.13,27.33 37.15,27.35 | v27.3,8.9 30.28,8.9 U$2.1
  Bottom 0.254: U15.P3 33.08,29.23 30.75,31.55 25.85,31.55 25.3,30.95 v25.3,29.25 25.3,28.8 24.95,28.45 24.65,28.45 24.3,28.1 24.3,26.9 26.55,24.65 26.55,17.55 25.8,16.8 25.8,16 26.3,15.5 28.9,15.5 30.3,14.15 30.3,9.8 29.7,9.2 27.6,9.2 v27.3,8.9
  other vias: 37.5,22.85
N$2
  Top 0.254: R4.2 36.72,39.01 37.45,39.01 U18.3
N$3
  Top 0.254: C9.1 37.45,36.18 U18.4
N$4
  Top 0.254: U3.P$40 26.55,40.9 25.95,41.5 21.95,41.5 21.65,41.2 21.25,40.71 C3.1 20.94,40.3 20.8,40.3 19.37,38.87 X2.P$3
N$5
  Top 0.254: U3.P$56 19.5,33.35 19.35,33.5 17.55,33.5 17.45,33.4 C11.1
  pour Top (isolate 0.254): 21.35,33.2 19.45,33.2 19.35,33.3 17.95,33.3 17.95,32 14.75,32 14.75,33.7 19.35,33.7 19.55,33.5 21.35,33.5
N$6
  Top 0.153: 21.35,42.1 21.35,42.83 C2.1
  Top 0.254: U3.P$39 27.06,40.79 27.05,40.8 27.05,41.1 26.15,42 21.45,42 21.43,42.02 | 21.43,42.02 21.35,42.1 | X2.P$1 19.41,42.02 21.43,42.02
N$7  (via drill 0.9)
  other vias: 16.8,28.55
N$8
  Top 0.254: X4.P$1 36.67,8.98 | X4.P$1 36.21,10.33 | 36.21,10.33 36.1,10.8 | C5.1 36.4,7.6 X4.P$1 | U$2.8 31.67,14.48 32.5,13.65 35.55,13.65 36.21,12.99 36.21,10.33
N$9
  Top 0.254: C13.1 32.75,8.54 32.75,9.5 32.8,9.55 X4.P$3 35.1,11.35 35.1,12.85 34.8,13.15 32.35,13.15 31.8,13.7 30.33,13.7 U$2.7
N$10  (2 unrouted)
N$11  (via drill 0.9)
  other vias: 20.66,23.18
N$12
  Top 0.153: R7.R7A R7.R8A
N$14
  Top 0.17: 9.65,2.95 7.55,2.95 7.45,2.85 6.6,2.85 6.32,2.57 U7.1A
  Top 0.254: R12.1 9.8,3.1 9.65,2.95
N$18  (via drill 0.9)
  other vias: 34.45,27.4
N$19  (2 unrouted)
N$20  (1 unrouted)
N$21  (1 unrouted)
N$24  (via drill 0.9)
  other vias: 43.09,36.45
N$25
  Top 0.254: U13.1A 44.2,2.77 R13.1
N$26
  Top 0.254: U7.2A 8.05,2.15 R11.1
N$30
  Top 0.254: U13.2A 44.2,3.68 R14.1
N$33
  Top 0.153: R2.R5A R2.R6A
N$35
  Top 0.153: R7.R3A R7.R4A
N$36
  Top 0.153: R2.R1A R2.R2A
NONSENSE  (via drill 0.38)
  Top 0.152: v21.62,47.13 21.14,47.13 20.75,46.75
  Top 0.153: 21.4,45.55 U$20.6 20.82,45.92 20.75,46 | R2.R6B R2.R7B R2.R8B 20.75,46 | U3.P$28 31.25,34.85 30.6,35.5 v30.6,35.85 | 20.75,46.75 20.75,46
  Bottom 0.153: v30.6,35.85 30.6,35.95 29.69,35.95 27.33,38.31 27.33,44.76 26.76,45.33 21.9,45.33 21.36,45.87 21.36,46.96 v21.62,47.13
R
  Top 0.254: 29.14,23.35 R16.R4A 27.73,23.41 27.56,23.58 25.11,23.58 U8.RED
RAIL1  (via drill 0.38)  (12 unrouted)
  Top 0.152: R7.R4B 25.35,46.56 25.55,46.76 29.51,46.76 v29.85,47.1
  Top 0.254: v35.57,41.6 36.09,41.6
  Bottom 0.153: 34.68,41.91 34.47,42.12 33.24,42.12 32.88,42.48 30.42,42.48 29.85,43.05 v29.85,47.1
  Bottom 0.254: 34.68,41.91 35.26,41.91 v35.57,41.6
RAIL1SENSE  (via drill 0.38)
  Top 0.152: v23.12,47.2 22.95,47.2 22.73,46.99 22.73,45.96 U$20.4
  Top 0.153: U$20.4 23.77,45.92 R7.R1B R7.R2B R7.R3B 24.39,45.99 | U3.P$30 32.9,35.85 33.1,36.05 33.1,37.21 32.94,37.37 32.25,37.37 v31.66,37.96
  Bottom 0.152: 25.65,45.66 22.96,45.66 U$20.4 22.7,46.78 v23.12,47.2
  Bottom 0.153: v31.66,37.96 v31.66,37.97 31.62,38.01 28.23,38.01 27.66,38.58 27.66,44.88 26.88,45.66 25.65,45.66
RAIL2  (13 unrouted)
RAIL2SENSE  (via drill 0.38)
  Top 0.153: 21.4,44.75 U$20.1 21.4,45.05 21.25,45.2 18.35,45.2 18.15,45.4 R2.R4B R2.R3B | R2.R3B R2.R2B | R2.R3B 17.65,46.75 v17.7,47.13
  Top 0.254: v27.4,36.9 28,36.3 28,35.79 | U3.P$27 30.85,34.35 v30.59,34.48 | 28,35.79 28,35.3 | v26.98,33.47 28,34.49 28,35.79
  Bottom 0.153: 27,37.3 27,44.49 26.49,45 20.58,45 18.45,47.13 v17.7,47.13
  Bottom 0.254: v27.4,36.9 27,37.3 | v30.59,34.48 30.25,34.25 29.47,33.47 v26.98,33.47
RAWSENSE  (via drill 0.38)
  Top 0.152: R7.R7B 26.85,45.98 26.85,45.34 26.95,45.24 27.84,45.24 28.29,44.78 v28.49,44.78
  Top 0.153: U$20.3 23.43,45.2 25.65,45.2 25.85,45.4 R7.R5B R7.R6B R7.R7B 26.37,45.99 26.31,46.05 | U3.P$29 32.86,35.35 33.24,35.73 33.41,35.73 33.41,37.71 v32.88,38.24
  Bottom 0.152: v28.49,44.78 28.68,44.78 27.99,44.09
  Bottom 0.153: v32.88,38.24 v32.88,38.25 32.85,38.28 32.67,38.28 32.07,38.88 31.08,38.88 30.54,38.34 28.38,38.34 27.99,38.73 27.99,44.09
RED
  Top 0.254: R16.R4B 29.08,25.12 28.55,25.65 U3.P$13
RTS  (via drill 0.38)
  Top 0.254: v15.5,24.7 15.15,25.05 15.15,26.75 14.6,27.3 14.6,28.95 14.15,29.4 14.15,33.7 14.45,34 19.5,34 19.65,33.85 20.25,33.85 U3.P$55 | U$2.25 15.22,15.28 15,15.5 v15,16.4
  Bottom 0.254: v15.5,24.7 16.75,23.45 16.75,21.9 15.1,20.25 15.1,16.5 v15,16.4
SW
  Top 0.152: 37.66,48.52 37.72,48.58
  Top 0.406: L1.1 37.72,48.46 37.66,48.52 U2.14 | 37.72,48.58 37.72,48.77 37.32,49.17 U2.15
USBID  (via drill 0.38)
  Top 0.254: 32.5,43 v33.7,43 | 32.5,43 32.15,43 | v39.25,52.19 39.25,53.54 39.65,53.94 39.88,53.94 40.13,54.19 U25.4 40.13,54.63 | U3.P$33 30.06,40.16 31.11,41.21 R6.2 32.03,43 32.5,43
  Bottom 0.254: v33.7,43 32.5,43 32,43.5 32,45.8 32.4,46.2 33.2,46.2 33.55,45.85 36.65,45.85 39.6,48.8 39.6,51.14 39.25,51.49 v39.25,52.19
VBUS
  Top 0.406: U25.1 42.53,53.61 D1.A
VCC_5.0  (3 unrouted)
VDD  (3 unrouted)
  Top 0.254: U2.8 31.91,47.87 31.47,48.31 30.63,48.31 30.33,48.62 30.33,51.59 30.77,52.03 31.47,52.03 C6.2
  Top 0.406: C18.1 33.83,52.2 33.83,50.91 U2.4 U2.3
  Top 0.813: 33.83,52.43 33.77,52.37 U2.4 U2.2
  Top 1.016: C6.2 33.82,52.18 33.83,52.2
  Top 1.27: U$19.P$1 29.29,52.85 29.87,52.27 33.38,52.27 C18.1

### Text on the board
tPlace: RAW | GND | TY | HY
bPlace: TX
tNames: Robert Breznak | Alex Camilo | Kevin Harrington | Greg Cole
bNames: REV: D | Model: NR001 | 74:F7:26
tValues: WASP Connector | Power 6.6 to 12v
200bmp: /home/acamilo/Downloads/logo_blurb.bmp